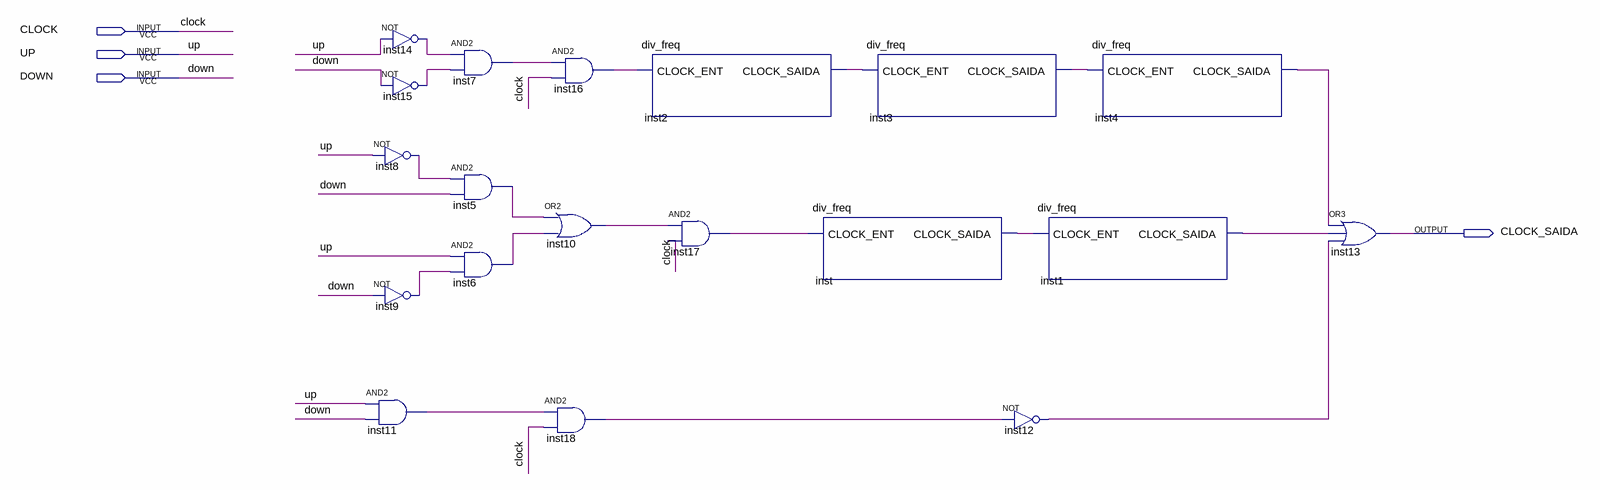
[diagram p0: schematic sheet]
// Quartus schematic SELETOR_CLOCK.bdf as structural Verilog: 19 symbols, 4 pins
module SELETOR_CLOCK (
  input  CLOCK,
  input  UP,
  input  DOWN,
  output CLOCK_SAIDA
);

  wire inst1_clock_saida, inst2_clock_saida, inst3_clock_saida, inst4_clock_saida, inst5_out, inst6_out,
       inst7_out, inst8_out, inst9_out, inst10_out, inst11_out, inst12_out, inst14_out, inst15_out,
       inst_clock_saida;

  not inst14 (inst14_out, UP);
  not inst15 (inst15_out, DOWN);
  not inst8 (inst8_out, UP);
  not inst9 (inst9_out, DOWN);
  and inst11 (inst11_out, UP, DOWN);
  and inst7 (inst7_out, inst14_out, inst15_out);
  and inst5 (inst5_out, inst8_out, DOWN);
  and inst6 (inst6_out, UP, inst9_out);
  and inst16 (inst7_out, inst7_out, CLOCK);
  or inst10 (inst10_out, inst5_out, inst6_out);
  and inst18 (inst11_out, inst11_out, CLOCK);
  div_freq inst2 (.CLOCK_ENT(inst7_out), .CLOCK_SAIDA(inst2_clock_saida));
  and inst17 (inst10_out, inst10_out, CLOCK);
  div_freq inst (.CLOCK_ENT(inst10_out), .CLOCK_SAIDA(inst_clock_saida));
  div_freq inst3 (.CLOCK_ENT(inst2_clock_saida), .CLOCK_SAIDA(inst3_clock_saida));
  not inst12 (inst12_out, inst11_out);
  div_freq inst1 (.CLOCK_ENT(inst_clock_saida), .CLOCK_SAIDA(inst1_clock_saida));
  div_freq inst4 (.CLOCK_ENT(inst3_clock_saida), .CLOCK_SAIDA(inst4_clock_saida));
  or inst13 (CLOCK_SAIDA, inst4_clock_saida, inst1_clock_saida, inst12_out);
endmodule
